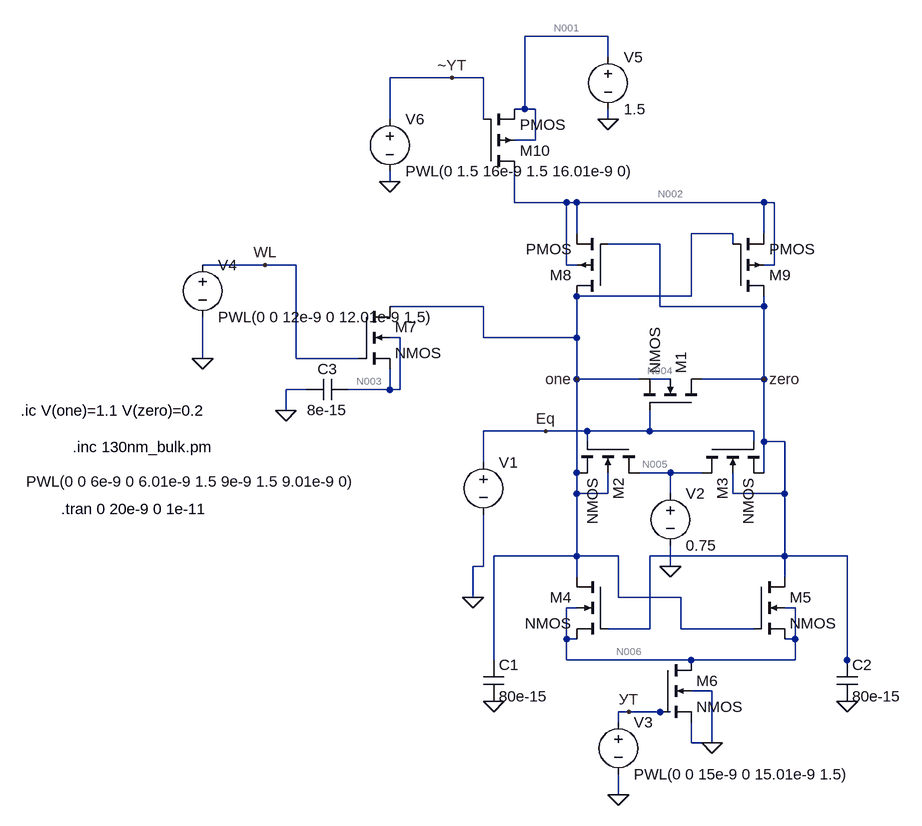
[diagram p0: schematic full_amplifaer.asc]
full_amplifaer.asc, the LTspice schematic file:
Version 4
SHEET 1 880 680
WIRE 208 -544 80 -544
WIRE 208 -512 208 -544
WIRE -32 -480 -128 -480
WIRE 16 -480 -32 -480
WIRE 80 -432 80 -544
WIRE 80 -432 64 -432
WIRE 96 -432 80 -432
WIRE -128 -416 -128 -480
WIRE 16 -416 16 -480
WIRE 208 -416 208 -432
WIRE 96 -384 96 -432
WIRE 96 -384 64 -384
WIRE -128 -320 -128 -336
WIRE 64 -288 64 -336
WIRE 144 -288 64 -288
WIRE 160 -288 144 -288
WIRE 448 -288 160 -288
WIRE 464 -288 448 -288
WIRE 160 -240 160 -288
WIRE 400 -240 336 -240
WIRE 448 -240 448 -288
WIRE 288 -224 208 -224
WIRE 400 -224 400 -240
WIRE -320 -192 -416 -192
WIRE -272 -192 -320 -192
WIRE 144 -192 144 -288
WIRE 160 -192 144 -192
WIRE 464 -192 464 -288
WIRE 464 -192 448 -192
WIRE 336 -144 336 -240
WIRE 336 -144 160 -144
WIRE 16 -128 -128 -128
WIRE 288 -128 288 -224
WIRE 448 -128 448 -144
WIRE 448 -128 288 -128
WIRE -112 -80 -128 -80
WIRE 16 -80 16 -128
WIRE 160 -80 160 -144
WIRE 160 -80 16 -80
WIRE -416 -48 -416 -112
WIRE -272 -48 -272 -192
WIRE -176 -48 -272 -48
WIRE 160 -16 160 -80
WIRE 256 -16 160 -16
WIRE 304 -16 272 -16
WIRE 448 -16 448 -128
WIRE 448 -16 352 -16
WIRE -256 0 -288 0
WIRE -128 0 -128 -32
WIRE -128 0 -192 0
WIRE -112 0 -112 -80
WIRE -112 0 -128 0
WIRE -288 32 -288 0
WIRE 112 64 16 64
WIRE 176 64 112 64
WIRE 272 64 272 32
WIRE 272 64 176 64
WIRE 432 64 272 64
WIRE 176 80 176 64
WIRE 432 80 432 64
WIRE 448 80 448 -16
WIRE 480 80 448 80
WIRE 16 112 16 64
WIRE 160 128 160 -16
WIRE 304 128 256 128
WIRE 352 128 304 128
WIRE 448 128 448 80
WIRE 160 160 160 128
WIRE 208 160 208 128
WIRE 208 160 160 160
WIRE 304 160 304 128
WIRE 400 160 400 128
WIRE 480 160 480 80
WIRE 480 160 400 160
WIRE 160 256 160 160
WIRE 160 256 32 256
WIRE 224 256 160 256
WIRE 480 256 480 160
WIRE 480 256 272 256
WIRE 576 256 480 256
WIRE 16 272 16 192
WIRE 16 272 0 272
WIRE 304 272 304 240
WIRE 160 288 160 256
WIRE 480 288 480 256
WIRE 0 320 0 272
WIRE 224 320 224 256
WIRE 320 320 224 320
WIRE 160 336 144 336
WIRE 496 336 480 336
WIRE 272 368 272 256
WIRE 272 368 208 368
WIRE 320 368 320 320
WIRE 432 368 320 368
WIRE 144 384 144 336
WIRE 160 384 144 384
WIRE 496 384 496 336
WIRE 496 384 480 384
WIRE 32 416 32 256
WIRE 144 416 144 384
WIRE 336 416 144 416
WIRE 496 416 496 384
WIRE 496 416 336 416
WIRE 576 416 576 256
WIRE 576 432 576 416
WIRE 368 464 336 464
WIRE 240 496 224 496
WIRE 288 496 240 496
WIRE 304 496 288 496
WIRE 224 512 224 496
WIRE 336 544 336 512
WIRE 368 544 368 464
WIRE 368 544 336 544
WIRE 224 624 224 592
FLAG 0 320 0
FLAG 160 -16 one
FLAG 448 -16 zero
FLAG 304 272 0
FLAG 576 480 0
FLAG 32 480 0
FLAG 368 544 0
FLAG 224 624 0
FLAG -288 32 0
FLAG -416 -48 0
FLAG 112 64 Eq
FLAG 240 496 УТ
FLAG -320 -192 WL
FLAG 208 -416 0
FLAG -128 -320 0
FLAG -32 -480 ~YT
SYMBOL nmos4 352 32 M270
SYMATTR InstName M1
SYMATTR Value2 l=130e-9 w=1300e-9 ad=676000e-18 as=676000e-18 pd=3640e-9 ps=3640e-9
SYMBOL nmos4 256 80 R90
SYMATTR InstName M2
SYMATTR Value2 l=130e-9 w=1300e-9 ad=676000e-18 as=676000e-18 pd=3640e-9 ps=3640e-9
SYMBOL nmos4 352 80 M90
SYMATTR InstName M3
SYMATTR Value2 l=130e-9 w=1300e-9 ad=676000e-18 as=676000e-18 pd=3640e-9 ps=3640e-9
SYMBOL voltage 16 96 R0
WINDOW 3 -704 45 Left 2
WINDOW 123 0 0 Left 0
WINDOW 39 0 0 Left 0
SYMATTR InstName V1
SYMATTR Value PWL(0 0 6e-9 0 6.01e-9 1.5 9e-9 1.5 9.01e-9 0)
SYMBOL voltage 304 144 R0
WINDOW 123 0 0 Left 0
WINDOW 39 0 0 Left 0
SYMATTR InstName V2
SYMATTR Value 0.75
SYMBOL cap 16 416 R0
SYMATTR InstName C1
SYMATTR Value 80e-15
SYMBOL cap 560 416 R0
SYMATTR InstName C2
SYMATTR Value 80e-15
SYMBOL nmos4 208 288 M0
SYMATTR InstName M4
SYMATTR Value2 l=130e-9 w=1300e-9 ad=676000e-18 as=676000e-18 pd=3640e-9 ps=3640e-9
SYMBOL nmos4 432 288 R0
SYMATTR InstName M5
SYMATTR Value2 l=130e-9 w=1300e-9 ad=676000e-18 as=676000e-18 pd=3640e-9 ps=3640e-9
SYMBOL nmos4 288 416 R0
SYMATTR InstName M6
SYMATTR Value2 l=130e-9 w=1300e-9 ad=676000e-18 as=676000e-18 pd=3640e-9 ps=3640e-9
SYMBOL voltage 224 496 R0
WINDOW 123 0 0 Left 0
WINDOW 39 0 0 Left 0
SYMATTR InstName V3
SYMATTR Value PWL(0 0 15e-9 0 15.01e-9 1.5)
SYMBOL nmos4 -176 -128 R0
SYMATTR InstName M7
SYMATTR Value2 l=130e-9 w=1300e-9 ad=676000e-18 as=676000e-18 pd=3640e-9 ps=3640e-9
SYMBOL cap -192 -16 R90
WINDOW 0 0 32 VBottom 2
WINDOW 3 32 32 VTop 2
SYMATTR InstName C3
SYMATTR Value 8e-15
SYMBOL voltage -416 -208 R0
WINDOW 123 0 0 Left 0
WINDOW 39 0 0 Left 0
SYMATTR InstName V4
SYMATTR Value PWL(0 0 12e-9 0 12.01e-9 1.5)
SYMBOL pmos4 208 -144 R180
SYMATTR InstName M8
SYMATTR Value2 l=130e-9 w=2600e-9 ad=676000e-18 as=676000e-18 pd=3640e-9 ps=3640e-9
SYMBOL pmos4 400 -144 M180
SYMATTR InstName M9
SYMATTR Value2 l=130e-9 w=12600e-9 ad=676000e-18 as=676000e-18 pd=3640e-9 ps=3640e-9
SYMBOL pmos4 16 -336 M180
SYMATTR InstName M10
SYMATTR Value2 l=130e-9 w=2600e-9 ad=676000e-18 as=676000e-18 pd=3640e-9 ps=3640e-9
SYMBOL voltage 208 -528 R0
WINDOW 123 0 0 Left 0
WINDOW 39 0 0 Left 0
SYMATTR InstName V5
SYMATTR Value 1.5
SYMBOL voltage -128 -432 R0
WINDOW 123 0 0 Left 0
WINDOW 39 0 0 Left 0
SYMATTR InstName V6
SYMATTR Value PWL(0 1.5 16e-9 1.5 16.01e-9 0)
TEXT -616 88 Left 2 !.inc 130nm_bulk.pm
TEXT -634 184 Left 2 !.tran 0 20e-9 0 1e-11
TEXT -696 32 Left 2 !.ic V(one)=1.1 V(zero)=0.2

The netlist it stands for:
* full_amplifaer.asc
M1 zero Eq one N004 NMOS l=130e-9 w=1300e-9 ad=676000e-18 as=676000e-18 pd=3640e-9 ps=3640e-9
M2 N005 Eq one one NMOS l=130e-9 w=1300e-9 ad=676000e-18 as=676000e-18 pd=3640e-9 ps=3640e-9
M3 N005 Eq zero zero NMOS l=130e-9 w=1300e-9 ad=676000e-18 as=676000e-18 pd=3640e-9 ps=3640e-9
V1 Eq 0 PWL(0 0 6e-9 0 6.01e-9 1.5 9e-9 1.5 9.01e-9 0)
V2 N005 0 0.75
C1 one 0 80e-15
C2 zero 0 80e-15
M4 one zero N006 N006 NMOS l=130e-9 w=1300e-9 ad=676000e-18 as=676000e-18 pd=3640e-9 ps=3640e-9
M5 zero one N006 N006 NMOS l=130e-9 w=1300e-9 ad=676000e-18 as=676000e-18 pd=3640e-9 ps=3640e-9
M6 N006 УТ 0 0 NMOS l=130e-9 w=1300e-9 ad=676000e-18 as=676000e-18 pd=3640e-9 ps=3640e-9
V3 УТ 0 PWL(0 0 15e-9 0 15.01e-9 1.5)
M7 one WL N003 N003 NMOS l=130e-9 w=1300e-9 ad=676000e-18 as=676000e-18 pd=3640e-9 ps=3640e-9
C3 N003 0 8e-15
V4 WL 0 PWL(0 0 12e-9 0 12.01e-9 1.5)
M8 one zero N002 N002 PMOS l=130e-9 w=2600e-9 ad=676000e-18 as=676000e-18 pd=3640e-9 ps=3640e-9
M9 zero one N002 N002 PMOS l=130e-9 w=12600e-9 ad=676000e-18 as=676000e-18 pd=3640e-9 ps=3640e-9
M10 N002 ~YT N001 N001 PMOS l=130e-9 w=2600e-9 ad=676000e-18 as=676000e-18 pd=3640e-9 ps=3640e-9
V5 N001 0 1.5
V6 ~YT 0 PWL(0 1.5 16e-9 1.5 16.01e-9 0)
.model NMOS NMOS
.model PMOS PMOS
.lib standard.mos
.inc 130nm_bulk.pm
.tran 0 20e-9 0 1e-11
.ic V(one)=1.1 V(zero)=0.2
.backanno
.end

* Results of the author's LTspice run, read from the files saved beside the schematic
* Operating Point, zero values left out:
*   V(zero) = 200 mV
*   V(one) = 1.1 V
*   V(n004) = 373.4 mV
*   V(n005) = 750 mV
*   V(n006) = 200 mV
*   V(n003) = 347 mV
*   V(n002) = 1.1 V
*   V(~yt) = 1.5 V
*   V(n001) = 1.5 V
*   Id(M10) = -5.738 nA
*   Is(M10) = 5.737 nA
*   Id(M9) = -101.4 nA
*   Ig(M9) = 5.552 pA
*   Is(M9) = 101.4 nA
*   Id(M8) = 95.63 nA
*   Ig(M8) = -2.289 pA
*   Is(M8) = -95.63 nA
*   Id(M7) = 494.7 pA
*   Ig(M7) = -494.7 pA
*   Id(M6) = 3.677 nA
*   Is(M6) = -3.677 nA
*   Id(M5) = -12.86 nA
*   Ig(M5) = 579.4 pA
*   Is(M5) = 12.28 nA
*   Id(M4) = 16.09 nA
*   Ig(M4) = -129.6 pA
*   Is(M4) = -15.96 nA
*   Id(M3) = 73.93 pA
*   Ig(M3) = -44.9 pA
*   Is(M3) = -28.48 pA
*   Id(M2) = -122.2 pA
*   Ig(M2) = -547.7 pA
*   Ib(M2) = 176.5 pA
*   Is(M2) = 493.3 pA
*   Id(M1) = -259.4 pA
*   Ig(M1) = -493.5 pA
*   Is(M1) = 753.3 pA
*   I(V5) = -5.738 nA
*   I(V4) = 494.7 pA
*   I(V2) = 48.24 pA
*   I(V1) = 1.086 nA
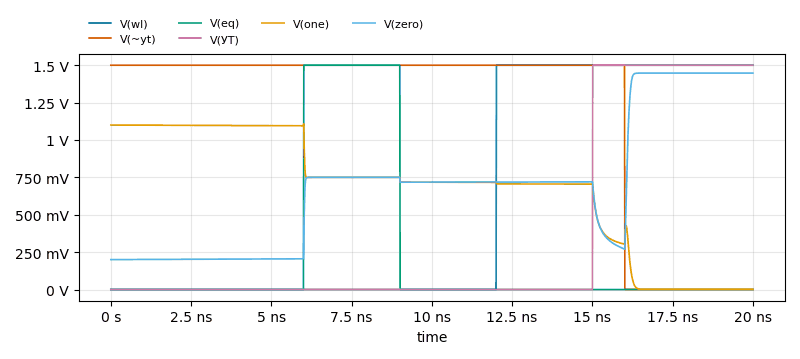
[diagram p1: Transient Analysis of full_amplifaer.asc, plotted from the saved traces]
* Transient Analysis, 1 run:
*   V(wl): min 0 V, max 1.5 V, average 599.6 mV, rms 948.3 mV, last 1.5 V
*   V(~yt): min 0 V, max 1.5 V, average 1.2 V, rms 1.342 V, last 0 V
*   V(eq): min 0 V, max 1.5 V, average 225 mV, rms 580.6 mV, last 0 V
*   V(УТ): min 0 V, max 1.5 V, average 374.6 mV, rms 749.5 mV, last 1.5 V
*   V(one): min 676.3 µV, max 1.107 V, average 678.5 mV, rms 779.3 mV, last 676.3 µV
*   V(zero): min 200 mV, max 1.448 V, average 690.7 mV, rms 815.7 mV, last 1.448 V